# EAGLE design cliff_sensor (EAGLE 9.6.1)
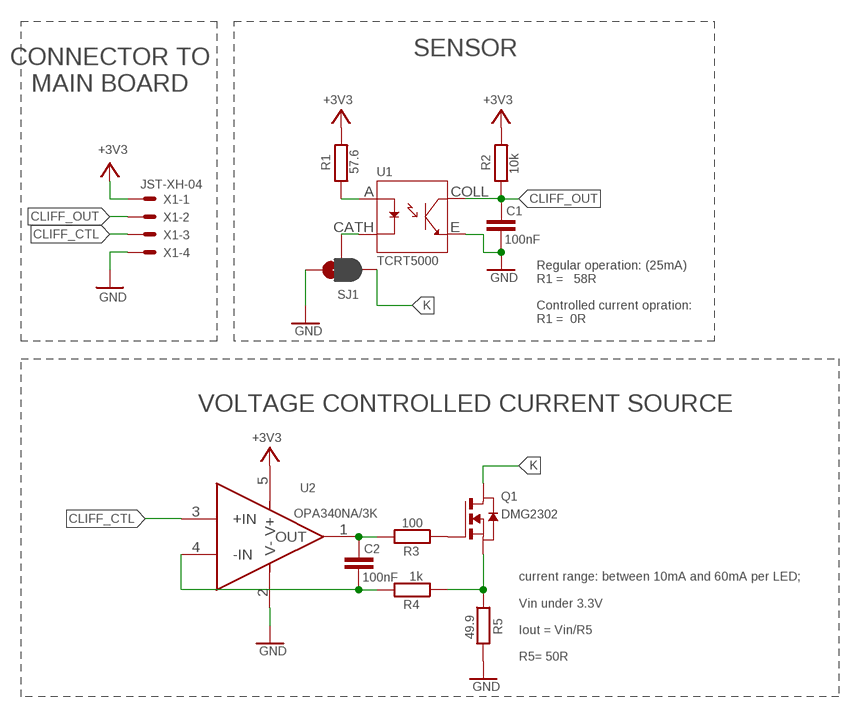
[diagram p0: schematic, sheet 1]

## Parts
C1  100nF  C-EUC0402  [C0402]
C2  100nF  C-EUC0402  [C0402]
Q1  DMG2302  NMOS-SOT23  [SOT-23]
R1  57.6  R-EU_R0402  [R0402]
R2  10k  R-EU_R0402  [R0402]
R3  100  R-EU_R0402  [R0402]
R4  1k  R-EU_R0402  [R0402]
R5  49.9  R-EU_R0402  [R0402]
SJ1  SPARKFUN-PASSIVES_JUMPER_PAD-3-1&2_NC_BY_PASTE  [SPARKFUN-PASSIVES_PAD-HUMPER-3-1&2_NC_BY_PASTE_YES_SILK_FULL_BOX]
U1  TCRT5000  [OPTO_TCRT5000]
U2  OPA340NA/3K  [SOT95P280X145-5N]
X1  JST-XH-04  JST-XH-04-PIN-ROUND-PAD  [JST-XH-04-PACKAGE-ROUND-PAD]

## Nets
+3V3: R1.2 R2.2 U2.5(V+) X1.1
CLIFF_CTL: U2.3(+IN) X1.3
CLIFF_OUT: C1.2 R2.1 U1.COLL X1.2
GND: C1.1 R5.2 SJ1.3 U1.E U2.2(V-) X1.4
K: Q1.D SJ1.1
N$2: SJ1.2 U1.CATH
N$3: C2.2 R3.2 U2.1(OUT)
N$4: C2.1 R4.2 U2.4(-IN)
N$5: Q1.G R3.1
N$6: Q1.S R4.1 R5.1
S_IN2: R1.1 U1.A

## Notes on the sheet
- SENSOR
- CONNECTOR TO
  MAIN BOARD
- Regular operation: (25mA)
  R1 =   58R
  
  Controlled current opration: 
  R1 =  0R
- VOLTAGE CONTROLLED CURRENT SOURCE
- current range: between 10mA and 60mA per LED; 
  
  Vin under 3.3V
  
  Iout = Vin/R5
  
  R5= 50R

## Library data of the parts
C1 C2 = rcl:C-EU: CAPACITOR, European symbol; SPICEPREFIX: C
Q1 = MOSFET:NMOS: N-Channel MOSFET
R1-R5 = rcl:R-EU_: RESISTOR, European symbol; SPICEPREFIX: R
SJ1 = SparkFun_MPU-9250_Breakout:SPARKFUN-PASSIVES_JUMPER_PAD-3-1&2_NC_BY_PASTE
U1 = TCRT5000:TCRT5000: 950 nm 60 mA Through Hole Reflective Optical Sensor with Transistor Output; AVAILABILITY: Unavailable; DESCRIPTION: Reflective Optical Sensor 0.591 _15mm_ PCB Mount; MF: Vishay; MP: TCRT5000; PACKAGE: PCB Mount Vishay; PRICE: None
U2 = OPA340NA_3K:OPA340NA/3K: SINGLE-SUPPLY RAIL-TO-RAIL OPERATIONAL AMPLIFIERS; AVAILABILITY: Unavailable; DESCRIPTION: General Purpose Amplifier 1 Circuit Rail-to-Rail SOT-23-5; MF: Texas Instruments; MP: OPA340NA/3K; PACKAGE: SOT-23-5 Texas Instruments; PRICE: None
X1 = con-jst-xh:JST-XH-04-PIN: JST XH Connector 2 Pin Wire to board connector. Pitch: 2,54 mm, (0.100") Number of pins: 4 Created by Rembrandt Electronics www.rembrandtelectronics.com

## Board
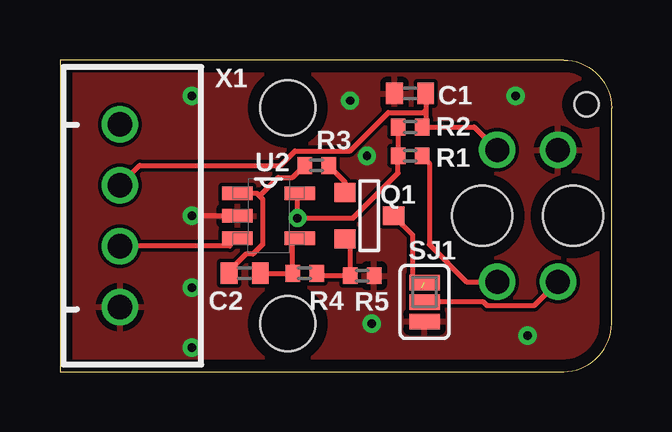
[diagram p1: board, top side]
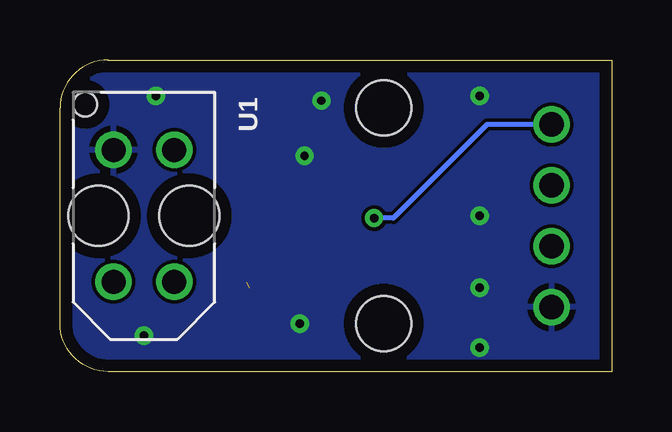
[diagram p2: board, bottom side, seen from below]

Size 23 x 13 mm. Coordinates in mm from the lower left corner, seen from the top.
Outline: 0,0 21,0 arc90 23,2 23,11 arc90 21,13 0,13 0,0
Copper layers (1*16): Top 0.035mm / dielectric 0.73mm / Bottom 0.035mm
Design rules "default *": minimum track width 6mil, minimum drill 0.35mm, track to track 6mil, track to pad 6mil, pad to pad 6mil, via to via 6mil, smd to smd 6mil, copper to edge 20mil, drill to drill 6mil, minimum pad ring 10mil, minimum via ring 8mil, stop-mask expansion 4mil, vias tented up to drill 0.4mm, thermal gap 10mil
Holes 2.3 mm at 9.5,11 9.5,2

### Footprints (pad centres in the part's own frame; a part is rotated, then mirrored left to right if it is on the bottom)
C0402 = smd 0.7 x 0.9: 1 -0.65,0; 2 0.65,0
SOT-23 = smd 0.787 x 0.889: D 0,1.016; G -0.965,-1.016; S 0.965,-1.016
R0402 = smd 0.6 x 0.7: 1 -0.5,0; 2 0.5,0
SPARKFUN-PASSIVES_PAD-HUMPER-3-1&2_NC_BY_PASTE_YES_SILK_FULL_BOX = smd 0.635 x 1.27: 1 -0.813,0; 2 0,0; 3 0.813,0
OPTO_TCRT5000 = drill 1 pad 1.5: A 2.75,1.27; CATH 2.75,-1.27; COLL -2.75,1.27; E -2.75,-1.27 | hole 1: -4.65,-2.45 | hole 2.5: 0,-1.9; 0,1.9
SOT95P280X145-5N = smd 1.27 x 0.559: 1 -1.295,0.94; 2 -1.295,0; 3 -1.295,-0.94; 4 1.295,-0.94; 5 1.295,0.94
JST-XH-04-PACKAGE-ROUND-PAD = drill 1.016: 1 -3.81,0; 2 -1.27,0; 3 1.27,0; 4 3.81,0

### Placement (x,y rotation side)
C1  14.6,11.6 0 top
C2  7.7,4.1 180 top
Q1  12.9,6.5 270 top
R1  14.6,9 180 top
R2  14.6,10.2 180 top
R3  10.7,8.6 180 top
R4  10.2,4.1 180 top
R5  12.6,4 0 top
SJ1  15.2,2.9 270 top
U1  19.5,6.5 270 bottom
U2  8.7,6.5 0 top
X1  2.5,6.5 270 top

### Tracks (layer width: path | path; a pad name or v marks a point on that pad's centre or on a via)
+3V3  (via drill 0.35)
  Top 0.2: R2.2 14.1,8.9 | 14.1,8.9 R1.2 | U2.5 9.9,7.34 v9.9,6.4 12.22,6.4 14.1,8.28 14.1,8.9
  Bottom 0.2: X1.1 5.19,10.31 9.1,6.4 v9.9,6.4
CLIFF_CTL
  Top 0.2: U2.3 7.07,5.23 X1.3
CLIFF_OUT
  Top 0.2: U1.COLL 17.28,10.2 R2.1 15.25,10.35 15.25,10.9 | C1.2 15.25,10.9 | X1.2 3.33,8.6 9.19,8.6 9.79,9.2 12.1,9.2 13.7,10.8 15.15,10.8 15.25,10.9
GND  (via drill 0.35)
  Top 0.2: U2.2 v5.5,6.5
  other vias: 5.5,3.5 5.5,1 5.5,11.5 13,2 12.8,9 12.1,11.3 19,11.5 19.5,1.5
  pour Top: -0.5,13.5 23.5,13.5 23.5,0 -0.5,0
  pour Bottom: -0.5,13.5 23.5,13.5 23.5,0 -0.5,0
K  (1 unrouted)
  Top 0.2: Q1.D 14.7,5.72 14.7,3.5 15.1,3.5
N$2
  Top 0.2: SJ1.2 17.66,2.9 17.81,2.74 19.76,2.74 U1.CATH
N$3
  Top 0.2: 8.32,7.32 8.21,7.44 U2.1 | 8.32,7.32 8.37,7.27 8.45,7.19 8.45,5.3 8.05,4.9 7.75,4.9 7.05,4.2 C2.2 | R3.2 9.7,8.1 9.1,8.1 8.32,7.32
N$4
  Top 0.2: 9.8,4.05 9.75,4.1 R4.2 | U2.4 9.94,5.56 9.7,5.32 R4.2 | C2.1 R4.2
N$5
  Top 0.2: R3.1 11.88,7.92 Q1.G
N$6
  Top 0.2: R4.1 10.8,4 R5.1 12.1,5.32 Q1.S
S_IN2
  Top 0.2: R1.1 15.4,8.7 15.4,5.3 16.95,3.75 U1.A